# EAGLE design MegaButton Shiled (EAGLE 7.3.0)
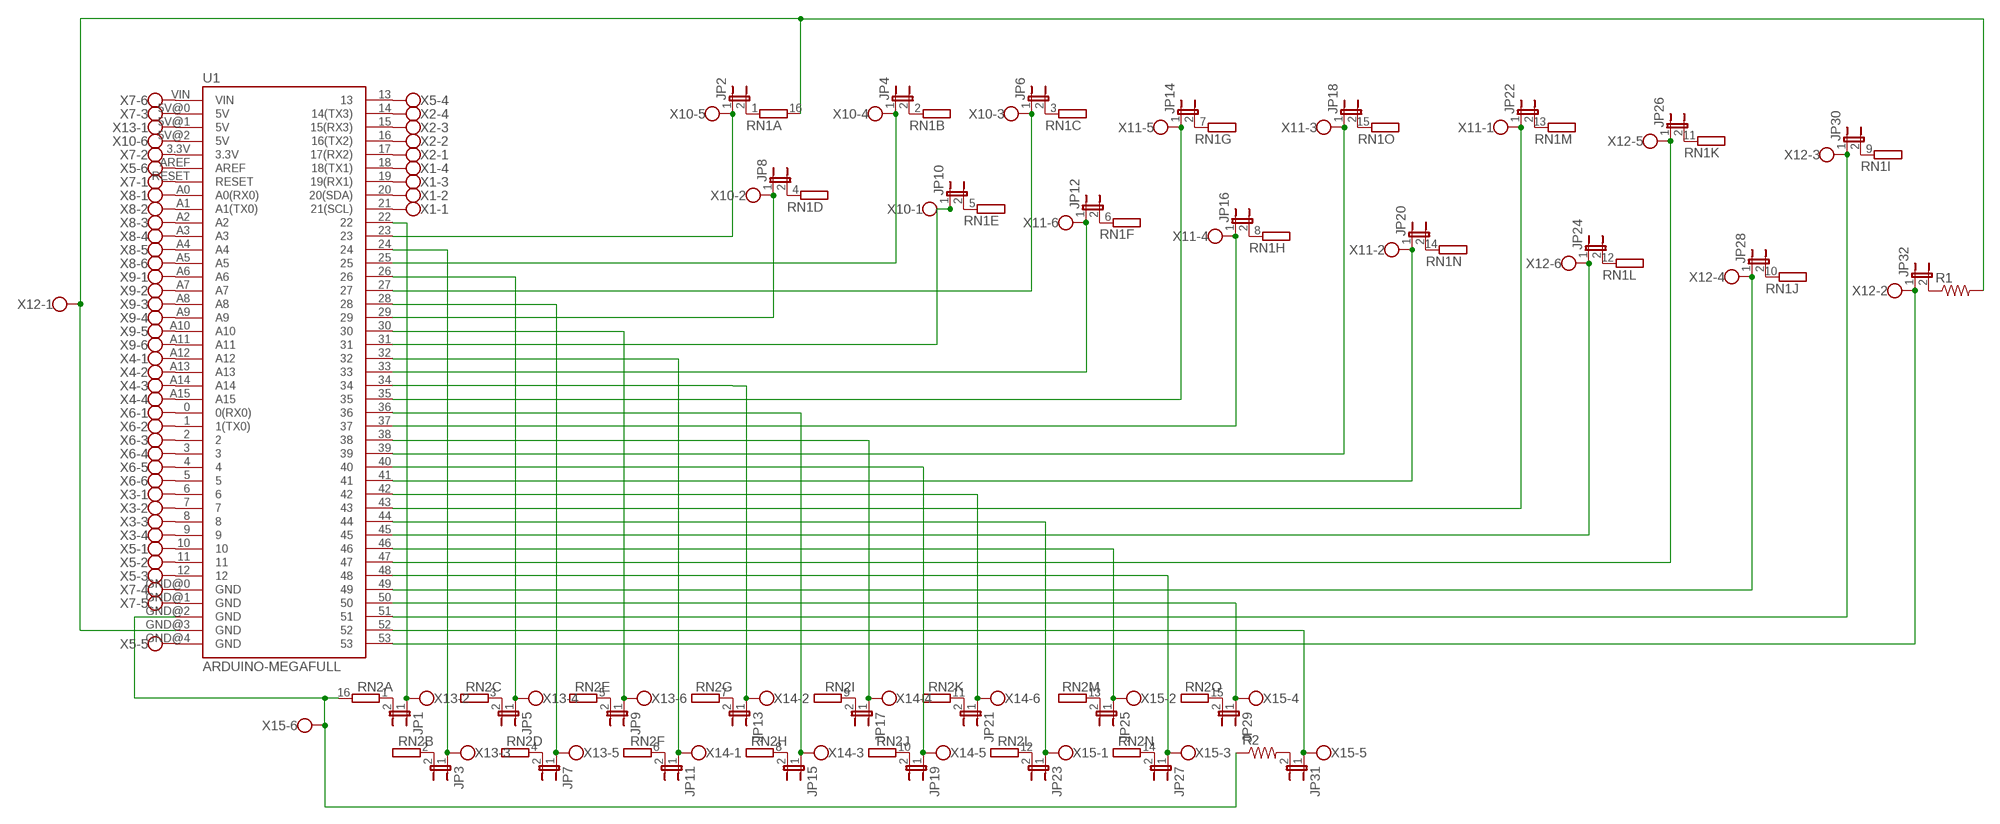
[diagram p0: schematic, sheet 1, part 1 of 2]
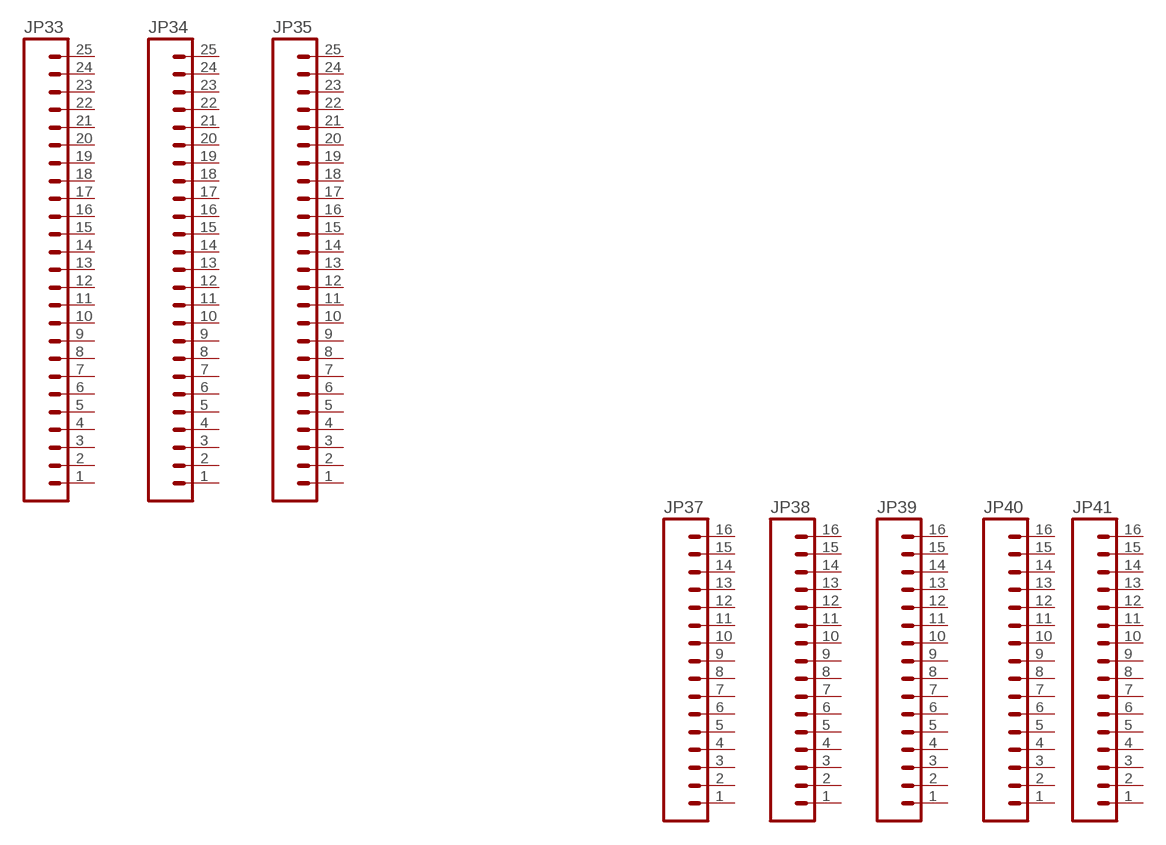
[diagram p1: schematic, sheet 1, part 2 of 2]

## Parts
JP1  JP1E  [JP1]
JP2  JP1E  [JP1]
JP3  JP1E  [JP1]
JP4  JP1E  [JP1]
JP5  JP1E  [JP1]
JP6  JP1E  [JP1]
JP7  JP1E  [JP1]
JP8  JP1E  [JP1]
JP9  JP1E  [JP1]
JP10  JP1E  [JP1]
JP11  JP1E  [JP1]
JP12  JP1E  [JP1]
JP13  JP1E  [JP1]
JP14  JP1E  [JP1]
JP15  JP1E  [JP1]
JP16  JP1E  [JP1]
JP17  JP1E  [JP1]
JP18  JP1E  [JP1]
JP19  JP1E  [JP1]
JP20  JP1E  [JP1]
JP21  JP1E  [JP1]
JP22  JP1E  [JP1]
JP23  JP1E  [JP1]
JP24  JP1E  [JP1]
JP25  JP1E  [JP1]
JP26  JP1E  [JP1]
JP27  JP1E  [JP1]
JP28  JP1E  [JP1]
JP29  JP1E  [JP1]
JP30  JP1E  [JP1]
JP31  JP1E  [JP1]
JP32  JP1E  [JP1]
JP33  M25PTH  [1X25]
JP34  M25PTH  [1X25]
JP35  M25PTH  [1X25]
JP37  M16PTH  [1X16]
JP38  M16PTH  [1X16]
JP39  M16PTH  [1X16]
JP40  M16PTH  [1X16]
JP41  M16PTH  [1X16]
R1  R-US_0204/5  [0204/5]
R2  R-US_0204/5  [0204/5]
RN1  E15R  [DIL16]
RN2  E15R  [DIL16]
U1  ARDUINO-MEGAFULL  [ARDUINO_MEGA]
X1  W237-4  [W237-4]
X2  W237-4  [W237-4]
X3  W237-4  [W237-4]
X4  W237-4  [W237-4]
X5  W237-136  [W237-136]
X6  W237-136  [W237-136]
X7  W237-136  [W237-136]
X8  W237-6  [W237-6]
X9  W237-6  [W237-6]
X10  W237-6  [W237-6]
X11  W237-6  [W237-6]
X12  W237-6  [W237-6]
X13  W237-6  [W237-6]
X14  W237-6  [W237-6]
X15  W237-6  [W237-6]

## Nets
N$1: U1.18(18(TX1)) X1.4
N$2: U1.19(19(RX1)) X1.3
N$3: U1.20(20(SDA)) X1.2
N$4: U1.21(21(SCL)) X1.1
N$5: U1.14(14(TX3)) X2.4
N$6: U1.15(15(RX3)) X2.3
N$7: U1.16(16(TX2)) X2.2
N$8: U1.17(17(RX2)) X2.1
N$9: U1.0(0(RX0)) X6.1
N$10: U1.1(1(TX0)) X6.2
N$11: U1.2 X6.3
N$12: U1.3 X6.4
N$13: U1.4 X6.5
N$14: U1.5 X6.6
N$15: U1.6 X3.1
N$16: U1.7 X3.2
N$17: U1.8 X3.3
N$18: U1.9 X3.4
N$19: U1.10 X5.1
N$20: U1.11 X5.2
N$21: U1.12 X5.3
N$22: U1.13 X5.4
N$23: U1.GND@4(GND) X5.5
N$24: U1.AREF X5.6
N$25: U1.RESET X7.1
N$26: U1.3.3V X7.2
N$27: U1.5V@0(5V) X7.3
N$28: U1.GND@0(GND) X7.4
N$29: U1.GND@1(GND) X7.5
N$30: U1.VIN X7.6
N$31: U1.A0(A0(RX0)) X8.1
N$32: U1.A1(A1(TX0)) X8.2
N$33: U1.A2 X8.3
N$34: U1.A3 X8.4
N$35: U1.A4 X8.5
N$36: U1.A5 X8.6
N$37: U1.A6 X9.1
N$38: U1.A7 X9.2
N$39: U1.A8 X9.3
N$40: U1.A9 X9.4
N$41: U1.A10 X9.5
N$42: U1.A11 X9.6
N$43: U1.A12 X4.1
N$44: U1.A13 X4.2
N$45: U1.A14 X4.3
N$46: U1.A15 X4.4
N$47: U1.5V@2(5V) X10.6
N$48: JP2.2 RN1.1
N$49: JP2.1 U1.23 X10.5
N$50: JP1.1 U1.22 X13.2
N$51: JP4.1 U1.25 X10.4
N$52: JP4.2 RN1.2
N$53: JP6.1 U1.27 X10.3
N$54: JP6.2 RN1.3
N$55: JP8.1 U1.29 X10.2
N$56: JP8.2 RN1.4
N$57: JP10.1 U1.31 X10.1
N$58: JP10.2 RN1.5
N$59: JP12.1 U1.33 X11.6
N$60: JP12.2 RN1.6
N$61: JP14.2 RN1.7
N$62: JP14.1 U1.35 X11.5
N$63: JP16.2 RN1.8
N$64: JP16.1 U1.37 X11.4
N$65: JP18.2 RN1.15
N$66: JP18.1 U1.39 X11.3
N$67: JP20.1 U1.41 X11.2
N$68: JP20.2 RN1.14
N$69: JP22.1 U1.43 X11.1
N$70: JP22.2 RN1.13
N$71: JP24.1 U1.45 X12.6
N$72: JP24.2 RN1.12
N$73: JP26.2 RN1.11
N$74: JP26.1 U1.47 X12.5
N$75: JP28.2 RN1.10
N$76: JP28.1 U1.49 X12.4
N$77: JP30.2 RN1.9
N$78: JP30.1 U1.51 X12.3
N$79: JP32.1 U1.53 X12.2
N$80: JP32.2 R1.1
N$82: JP1.2 RN2.1
N$83: U1.5V@1(5V) X13.1
N$85: JP3.2 RN2.2
N$86: JP3.1 U1.24 X13.3
N$87: JP5.2 RN2.3
N$88: JP5.1 U1.26 X13.4
N$89: JP7.2 RN2.4
N$90: JP7.1 U1.28 X13.5
N$91: JP9.2 RN2.5
N$92: JP9.1 U1.30 X13.6
N$93: JP11.2 RN2.6
N$94: JP11.1 U1.32 X14.1
N$95: JP13.2 RN2.7
N$96: JP13.1 U1.34 X14.2
N$97: JP15.2 RN2.8
N$98: JP15.1 U1.36 X14.3
N$99: JP17.2 RN2.9
N$100: JP17.1 U1.38 X14.4
N$101: JP19.2 RN2.10
N$102: JP19.1 U1.40 X14.5
N$103: JP21.2 RN2.11
N$104: JP21.1 U1.42 X14.6
N$105: JP23.2 RN2.12
N$106: JP23.1 U1.44 X15.1
N$107: JP25.2 RN2.13
N$108: JP25.1 U1.46 X15.2
N$109: R1.2 RN1.16 U1.GND@3(GND) X12.1
N$110: JP27.2 RN2.14
N$111: JP27.1 U1.48 X15.3
N$112: JP29.2 RN2.15
N$113: JP29.1 U1.50 X15.4
N$114: JP31.2 R2.2
N$115: JP31.1 U1.52 X15.5
N$130: R2.1 RN2.16 U1.GND@2(GND) X15.6
Unconnected: JP33.1 JP33.2 JP33.3 JP33.4 JP33.5 JP33.6 JP33.7 JP33.8 JP33.9 JP33.10 JP33.11 JP33.12 JP33.13 JP33.14 JP33.15 JP33.16 JP33.17 JP33.18 JP33.19 JP33.20 JP33.21 JP33.22 JP33.23 JP33.24 JP33.25 JP34.1 JP34.2 JP34.3 JP34.4 JP34.5 JP34.6 JP34.7 JP34.8 JP34.9 JP34.10 JP34.11 JP34.12 JP34.13 JP34.14 JP34.15 JP34.16 JP34.17 JP34.18 JP34.19 JP34.20 JP34.21 JP34.22 JP34.23 JP34.24 JP34.25 JP35.1 JP35.2 JP35.3 JP35.4 JP35.5 JP35.6 JP35.7 JP35.8 JP35.9 JP35.10 JP35.11 JP35.12 JP35.13 JP35.14 JP35.15 JP35.16 JP35.17 JP35.18 JP35.19 JP35.20 JP35.21 JP35.22 JP35.23 JP35.24 JP35.25 JP37.1 JP37.2 JP37.3 JP37.4 JP37.5 JP37.6 JP37.7 JP37.8 JP37.9 JP37.10 JP37.11 JP37.12 JP37.13 JP37.14 JP37.15 JP37.16 JP38.1 JP38.2 JP38.3 JP38.4 JP38.5 JP38.6 JP38.7 JP38.8 JP38.9 JP38.10 JP38.11 JP38.12 JP38.13 JP38.14 JP38.15 JP38.16 JP39.1 JP39.2 JP39.3 JP39.4 JP39.5 JP39.6 JP39.7 JP39.8 JP39.9 JP39.10 JP39.11 JP39.12 JP39.13 JP39.14 JP39.15 JP39.16 JP40.1 JP40.2 JP40.3 JP40.4 JP40.5 JP40.6 JP40.7 JP40.8 JP40.9 JP40.10 JP40.11 JP40.12 JP40.13 JP40.14 JP40.15 JP40.16 JP41.1 JP41.2 JP41.3 JP41.4 JP41.5 JP41.6 JP41.7 JP41.8 JP41.9 JP41.10 JP41.11 JP41.12 JP41.13 JP41.14 JP41.15 JP41.16

## Library data of the parts
JP1-JP32 = jumper:JP1E: JUMPER
JP33-JP35 = SparkFun-Connectors:M25: 1x25 .1" header
JP37-JP41 = SparkFun-Connectors:M16: 1x16 .1" header
R1 R2 = resistor:R-US_: RESISTOR, American symbol
RN1 RN2 = resistor-dil:E15R: DIL RESISTOR; OC_FARNELL: unknown; OC_NEWARK: unknown
U1 = SparkFun-Boards:ARDUINO-MEGA: Arduino Mega board footprint
X1-X4 = con-wago-500:W237-4: WAGO SCREW CLAMP; OC_FARNELL: unknown; OC_NEWARK: unknown
X5-X7 = con-wago-500:W237-136: WAGO SCREW CLAMP; MPN: 237-136; OC_FARNELL: unknown; OC_NEWARK: 84K9151
X8-X15 = con-wago-500:W237-6: WAGO SCREW CLAMP; OC_FARNELL: unknown; OC_NEWARK: unknown

## Board
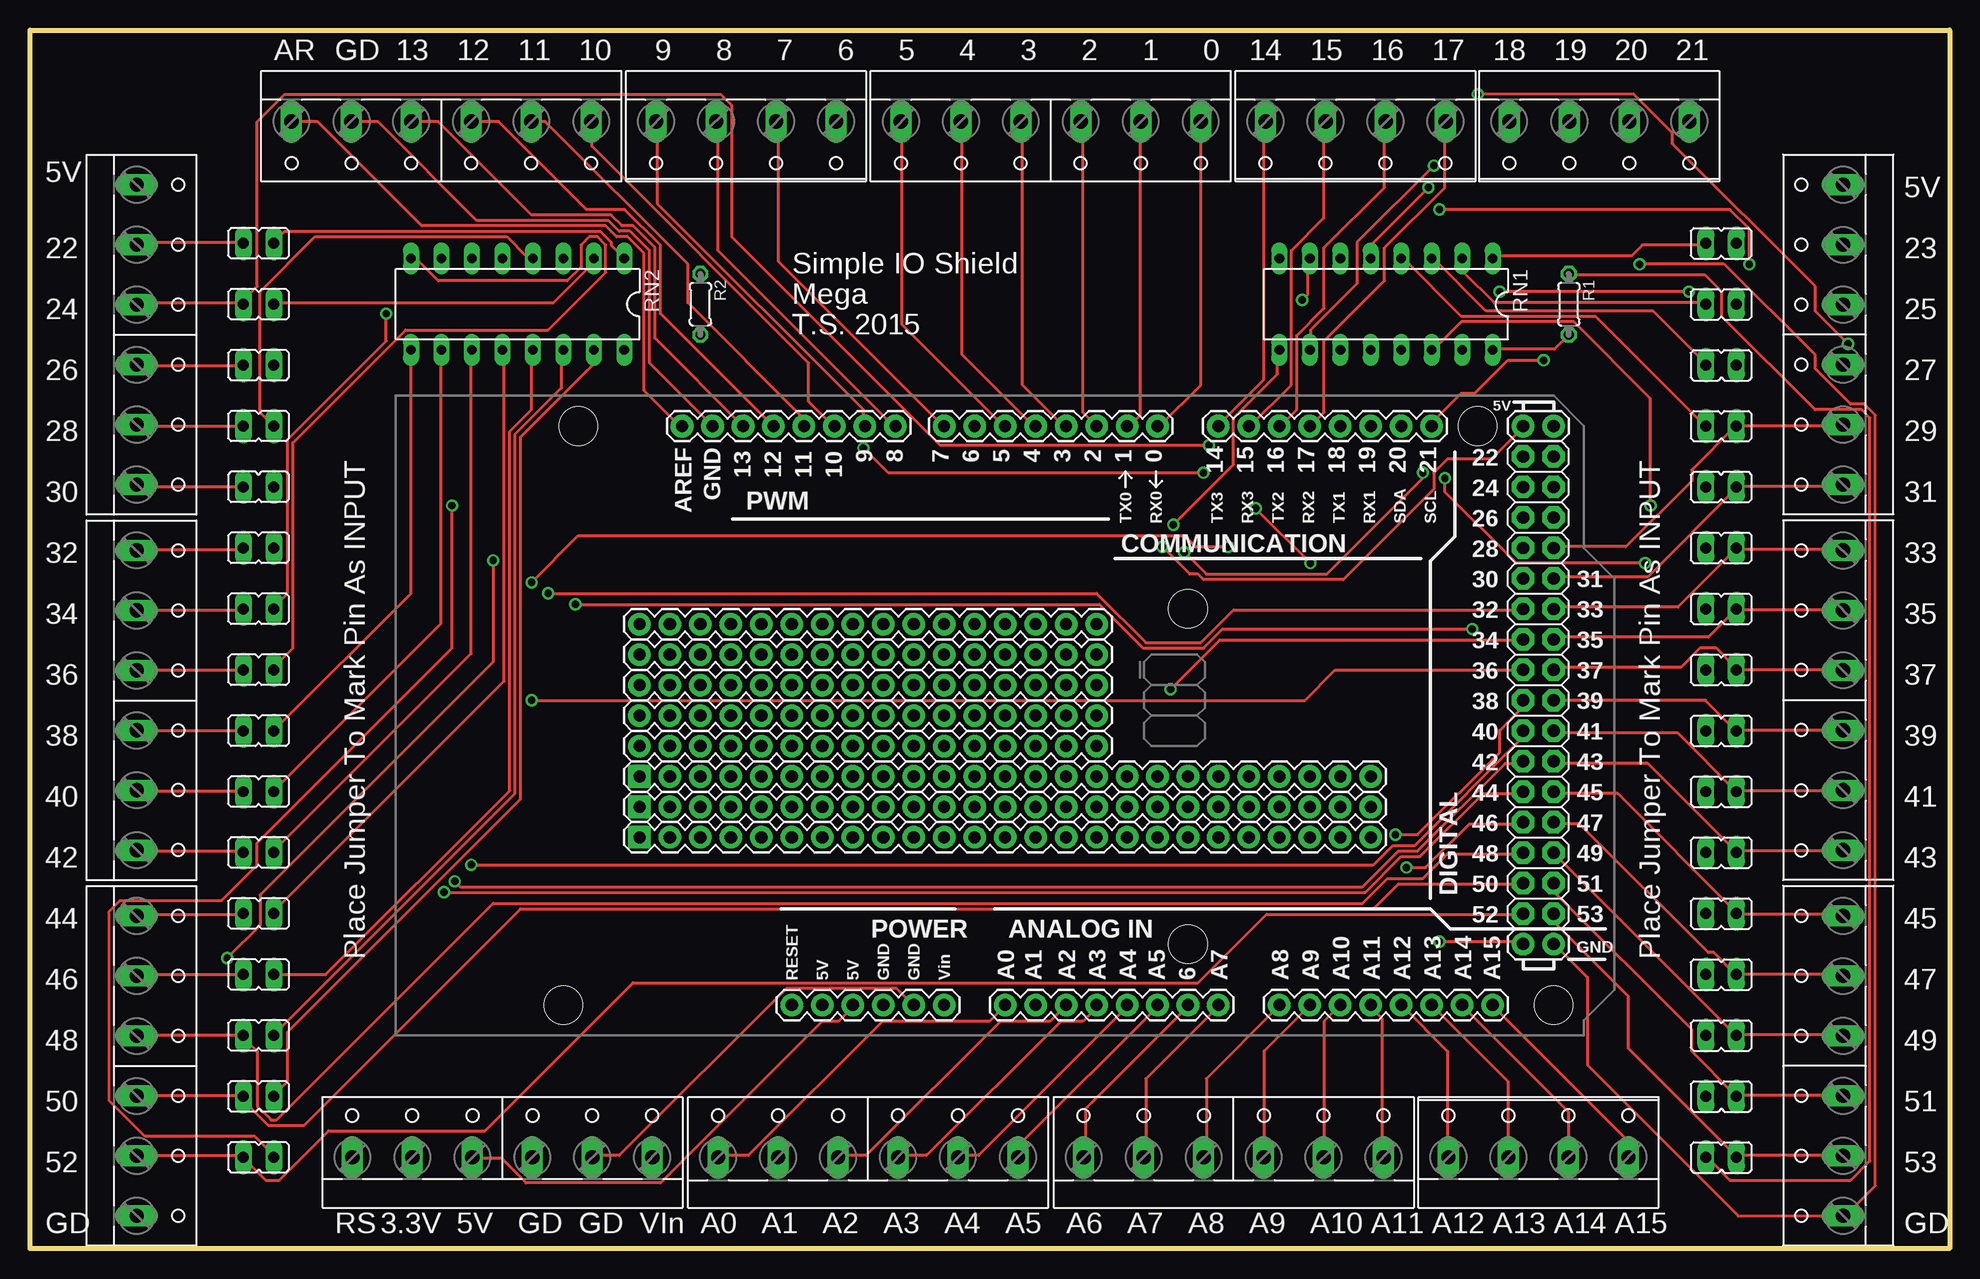
[diagram p2: board, top side]
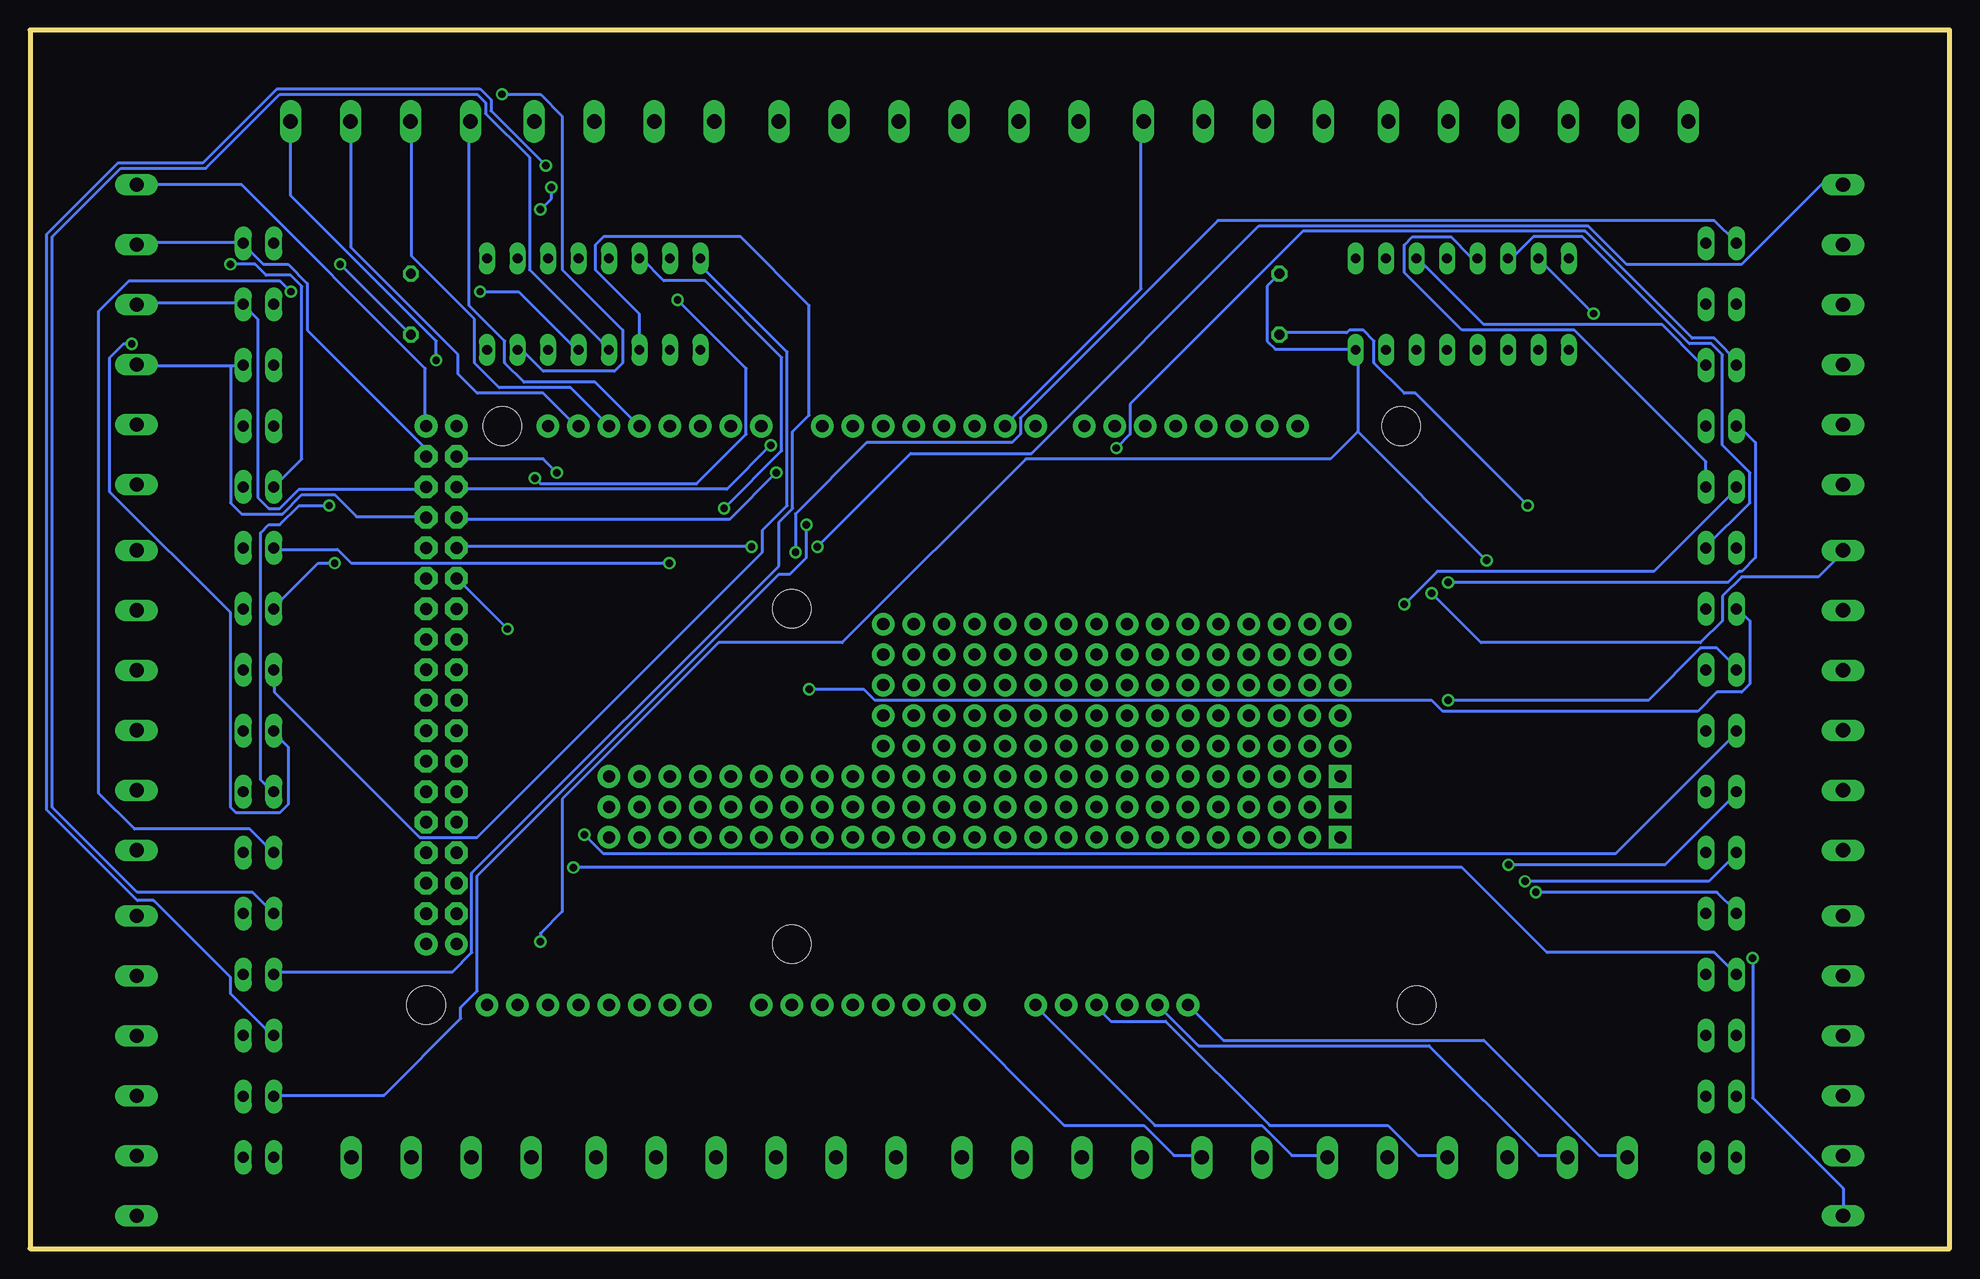
[diagram p3: board, bottom side, seen from below]

Size 160.02 x 101.6 mm. Coordinates in mm from the lower left corner, seen from the top.
Outline: 0,0 0,101.6 160.02,101.6 160.02,0 0,0
Copper layers (1*16): Top 0.035mm / dielectric 1.5mm / Bottom 0.035mm
Design rules "default": minimum track width 10mil, minimum drill 24mil, track to track 8mil, track to pad 8mil, pad to pad 8mil, via to via 8mil, smd to smd 8mil, copper to edge 40mil, drill to drill 8mil, minimum pad ring 10mil, minimum via ring 8mil, stop-mask expansion 4mil, vias tented up to drill 0mil, thermal gap 10mil

### Footprints (pad centres in the part's own frame; a part is rotated, then mirrored left to right if it is on the bottom)
JP1 = drill 0.914 long: 1 0,-1.27; 2 0,1.27
1X25 = drill 1.016 pad 1.88 square: 1 0,0 | drill 1.016 pad 1.88: 2 2.54,0; 3 5.08,0; 4 7.62,0; 5 10.16,0; 6 12.7,0; 7 15.24,0; 8 17.78,0; 9 20.32,0; 10 22.86,0; 11 25.4,0; 12 27.94,0; 13 30.48,0; 14 33.02,0; 15 35.56,0; 16 38.1,0; 17 40.64,0; 18 43.18,0; 19 45.72,0; 20 48.26,0; 21 50.8,0; 22 53.34,0; 23 55.88,0; 24 58.42,0; 25 60.96,0
1X16 = drill 1.016 pad 1.88: 1 0,0; 2 2.54,0; 3 5.08,0; 4 7.62,0; 5 10.16,0; 6 12.7,0; 7 15.24,0; 8 17.78,0; 9 20.32,0; 10 22.86,0; 11 25.4,0; 12 27.94,0; 13 30.48,0; 14 33.02,0; 15 35.56,0; 16 38.1,0
0204/5 = drill 0.813 octagon: 1 -2.54,0; 2 2.54,0
DIL16 = drill 0.813 long: 1 -8.89,-3.81; 2 -6.35,-3.81; 3 -3.81,-3.81; 4 -1.27,-3.81; 5 1.27,-3.81; 6 3.81,-3.81; 7 6.35,-3.81; 8 8.89,-3.81; 9 8.89,3.81; 10 6.35,3.81; 11 3.81,3.81; 12 1.27,3.81; 13 -1.27,3.81; 14 -3.81,3.81; 15 -6.35,3.81; 16 -8.89,3.81
ARDUINO_MEGA = drill 1.016 pad 1.88: 0 63.5,50.8; 1 60.96,50.8; 2 58.42,50.8; 3 55.88,50.8; 3.3V 35.56,2.54; 4 53.34,50.8; 5 50.8,50.8; 5V@0 38.1,2.54; 5V@1 93.98,50.8; 5V@2 96.52,50.8; 6 48.26,50.8; 7 45.72,50.8; 8 41.656,50.8; 9 39.116,50.8; 10 36.576,50.8; 11 34.036,50.8; 12 31.496,50.8; 13 28.956,50.8; 14 68.58,50.8; 15 71.12,50.8; 16 73.66,50.8; 17 76.2,50.8; 18 78.74,50.8; 19 81.28,50.8; 20 83.82,50.8; 21 86.36,50.8; A0 50.8,2.54; A1 53.34,2.54; A2 55.88,2.54; A3 58.42,2.54; A4 60.96,2.54; A5 63.5,2.54; A6 66.04,2.54; A7 68.58,2.54; A8 73.66,2.54; A9 76.2,2.54; A10 78.74,2.54; A11 81.28,2.54; A12 83.82,2.54; A13 86.36,2.54; A14 88.9,2.54; A15 91.44,2.54; AREF 23.876,50.8; GND@0 40.64,2.54; GND@1 43.18,2.54; GND@2 93.98,7.62; GND@3 96.52,7.62; GND@4 26.416,50.8; RESET 33.02,2.54; VIN 45.72,2.54 | drill 1.016 pad 1.88 octagon: 22 93.98,48.26; 23 96.52,48.26; 24 93.98,45.72; 25 96.52,45.72; 26 93.98,43.18; 27 96.52,43.18; 28 93.98,40.64; 29 96.52,40.64; 30 93.98,38.1; 31 96.52,38.1; 32 93.98,35.56; 33 96.52,35.56; 34 93.98,33.02; 35 96.52,33.02; 36 93.98,30.48; 37 96.52,30.48; 38 93.98,27.94; 39 96.52,27.94; 40 93.98,25.4; 41 96.52,25.4; 42 93.98,22.86; 43 96.52,22.86; 44 93.98,20.32; 45 96.52,20.32; 46 93.98,17.78; 47 96.52,17.78; 48 93.98,15.24; 49 96.52,15.24; 50 93.98,12.7; 51 96.52,12.7; 52 93.98,10.16; 53 96.52,10.16 | hole 3.2: 15.24,50.8; 13.97,2.54; 66.04,35.56; 66.04,7.62; 90.17,50.8; 96.52,2.54
W237-4 = drill 1.194 long: 1 -7.5,-1.27; 2 -2.5,-1.27; 3 2.5,-1.27; 4 7.5,-1.27
W237-136 = drill 1.194 long: 1 -12.5,-1.27; 2 -7.5,-1.27; 3 -2.5,-1.27; 4 2.5,-1.27; 5 7.5,-1.27; 6 12.5,-1.27
W237-6 = drill 1.194 long: 1 -12.5,-1.27; 2 -7.5,-1.27; 3 -2.5,-1.27; 4 2.5,-1.27; 5 7.5,-1.27; 6 12.5,-1.27

### Placement (x,y rotation side)
JP1  19.05,83.82 270 top
JP2  140.97,83.82 90 top
JP3  19.05,78.74 270 top
JP4  140.97,78.74 90 top
JP5  19.05,73.66 270 top
JP6  140.97,73.66 90 top
JP7  19.05,68.58 270 top
JP8  140.97,68.58 90 top
JP9  19.05,63.5 270 top
JP10  140.97,63.5 90 top
JP11  19.05,58.42 270 top
JP12  140.97,58.42 90 top
JP13  19.05,53.34 270 top
JP14  140.97,53.34 90 top
JP15  19.05,48.26 270 top
JP16  140.97,48.26 90 top
JP17  19.05,43.18 270 top
JP18  140.97,43.18 90 top
JP19  19.05,38.1 270 top
JP20  140.97,38.1 90 top
JP21  19.05,33.02 270 top
JP22  140.97,33.02 90 top
JP23  19.05,27.94 270 top
JP24  140.97,27.94 90 top
JP25  19.05,22.86 270 top
JP26  140.97,22.86 90 top
JP27  19.05,17.78 270 top
JP28  140.97,17.78 90 top
JP29  19.05,12.7 270 top
JP30  140.97,12.7 90 top
JP31  19.05,7.62 270 top
JP32  140.97,7.62 90 top
JP33  50.8,39.37 0 top
JP34  50.8,36.83 0 top
JP35  50.8,34.29 0 top
JP37  50.8,41.91 0 top
JP38  50.8,44.45 0 top
JP39  50.8,46.99 0 top
JP40  50.8,49.53 0 top
JP41  50.8,52.07 0 top
R1  128.27,78.74 270 top
R2  55.88,78.74 270 top
RN1  113.03,78.74 180 top
RN2  40.64,78.74 180 top
U1  30.48,17.78 0 top
X1  130.81,92.71 180 top
X2  110.49,92.71 180 top
X3  59.69,92.71 180 top
X4  125.73,8.89 0 top
X5  34.29,92.71 180 top
X6  85.09,92.71 180 top
X7  39.37,8.89 0 top
X8  69.85,8.89 0 top
X9  100.33,8.89 0 top
X10  149.86,76.2 90 top
X11  149.86,45.72 90 top
X12  149.86,15.24 90 top
X13  10.16,76.2 270 top
X14  10.16,45.72 270 top
X15  10.16,15.24 270 top

### Tracks (layer width: path | path; a pad name or v marks a point on that pad's centre or on a via)
N$1
  Bottom 0.254: X1.4 123.42,93.95 123.42,78.64 120.45,75.67 120.45,73.84 118.85,72.24 112.9,72.24 109.24,68.58 U1.18
N$2
  Bottom 0.254: U1.19 114.96,71.78 120.9,71.78 122.96,73.84 122.96,77.5 128.22,82.75 128.22,93.95 X1.3
N$3
  Bottom 0.254: X1.2 133.25,93.95 133.25,83.44 124.33,74.52 124.33,72.92 122.73,71.32 117.25,71.32 114.5,68.58 U1.20
N$4  (via drill 0.61)
  Top 0.254: v126.16,74.07 123.19,74.07 120.45,71.32 119.3,71.32 117.02,69.04 117.02,68.58 U1.21
  Bottom 0.254: v126.16,74.07 126.16,75.67 138.28,87.78 138.28,93.95 X1.1
N$5
  Top 0.254: X2.4 102.84,93.95 102.84,72.47 98.96,68.58 U1.14
N$6
  Top 0.254: X2.3 107.87,93.95 107.87,85.95 105.13,83.21 105.13,72.01 101.7,68.58 U1.15
N$7
  Top 0.254: X2.2 112.9,93.95 112.9,88.47 107.87,83.44 107.87,78.41 105.59,76.12 105.59,69.95 104.22,68.58 U1.16
N$8
  Top 0.254: X2.1 117.93,93.95 117.93,88.47 112.9,83.44 112.9,80.7 107.87,75.67 107.87,69.72 106.73,68.58 U1.17
N$9
  Top 0.254: X6.1 97.59,93.95 97.59,72.01 94.16,68.58 U1.0
N$10
  Top 0.254: X6.2 92.56,93.95 92.56,69.49 91.64,68.58 U1.1
N$11
  Top 0.254: U1.2 87.76,69.72 87.76,93.95 X6.3
N$12
  Top 0.254: X6.4 82.73,93.95 82.73,72.01 86.16,68.58 U1.3
N$13
  Top 0.254: X6.5 77.7,93.95 77.7,74.52 83.64,68.58 U1.4
N$14
  Top 0.254: X6.6 72.67,93.95 72.67,77.04 81.13,68.58 U1.5
N$15
  Bottom 0.254: X3.1 67.41,93.95 67.41,80.01 78.84,68.58 U1.6
N$16
  Top 0.254: X3.2 62.38,93.95 62.38,82.3 76.1,68.58 U1.7
N$17
  Top 0.254: X3.3 57.35,93.95 57.35,83.21 71.98,68.58 U1.8
N$18
  Top 0.254: X3.4 52.32,93.95 52.32,87.1 69.47,69.95 69.47,68.58 U1.9
N$19
  Top 0.254: X5.1 46.84,93.95 46.84,91.9 64.9,73.84 64.9,70.64 66.95,68.58 U1.10
N$20
  Top 0.254: X5.2 41.81,93.95 42.95,93.95 54.84,82.07 54.84,78.87 64.44,69.27 64.44,68.58 U1.11
N$21
  Top 0.254: X5.3 37.01,93.95 39.06,93.95 46.38,86.64 49.58,86.64 52.55,83.67 52.55,77.95 61.93,68.58 U1.12
N$22
  Top 0.254: X5.4 31.98,93.95 34.04,93.95 41.81,86.18 48.44,86.18 49.35,85.27 50.27,85.27 52.09,83.44 52.09,75.89 59.41,68.58 U1.13
N$23
  Top 0.254: U1.GND@4 51.64,73.84 51.64,83.21 50.04,84.81 49.12,84.81 48.21,85.72 37.24,85.72 29.01,93.95 26.95,93.95 X5.5
N$24
  Top 0.254: X5.6 21.92,93.95 23.98,93.95 32.66,85.27 47.98,85.27 48.9,84.35 49.81,84.35 51.18,82.98 51.18,71.55 54.15,68.58 U1.AREF
N$25
  Bottom 0.254: U1.RESET 60.55,17.37 38.84,17.37 29.23,7.77 26.95,7.77 X7.1
N$26
  Bottom 0.254: X7.2 31.98,7.77 34.27,7.77 43.41,16.92 62.61,16.92 66.04,20.34 U1.3.3V
N$27
  Top 0.254: X7.3 37.01,7.54 39.29,7.54 41.35,5.49 52.55,5.49 66.04,18.97 67.41,18.97 68.55,20.12 U1.5V@0
N$28
  Bottom 0.254: X7.4 42.04,7.77 44.32,7.77 46.84,10.29 56.67,10.29 65.35,18.97 69.93,18.97 71.07,20.12 U1.GND@0
N$29
  Top 0.254: X7.5 47.07,7.77 49.12,7.77 63.07,21.72 72.21,21.72 73.58,20.34 U1.GND@1
N$30
  Bottom 0.254: X7.6 52.09,7.77 54.84,7.77 57.35,10.29 66.27,10.29 76.1,20.12 U1.VIN
N$31
  Top 0.254: X8.1 57.35,7.77 59.87,7.77 71.07,18.97 79.98,18.97 81.13,20.12 U1.A0
N$32
  Bottom 0.254: X8.2 62.38,7.77 64.67,7.77 67.18,10.29 73.81,10.29 83.64,20.12 U1.A1
N$33
  Top 0.254: U1.A2 85.01,18.97 80.9,18.97 69.7,7.77 67.41,7.77 X8.3
N$34
  Top 0.254: X8.4 72.44,7.77 74.73,7.77 85.93,18.97 87.76,18.97 88.9,20.12 U1.A3
N$35
  Top 0.254: X8.5 77.47,7.77 79.07,7.77 91.41,20.12 U1.A4
N$36
  Top 0.254: X8.6 82.5,7.77 82.5,8.69 93.93,20.12 U1.A5
N$37
  Top 0.254: X9.1 87.99,7.77 87.99,11.66 96.44,20.12 U1.A6
N$38
  Top 0.254: X9.2 93.02,7.77 93.02,14.17 98.96,20.12 U1.A7
N$39
  Top 0.254: X9.3 98.04,7.77 98.04,14.17 103.99,20.12 U1.A8
N$40
  Top 0.254: X9.4 102.84,7.77 102.84,16.46 106.5,20.12 U1.A9
N$41
  Top 0.254: U1.A10 107.87,18.97 107.87,7.77 X9.5
N$42
  Top 0.254: X9.6 112.67,7.77 112.67,19.2 111.76,20.12 U1.A11
N$43
  Top 0.254: U1.A12 118.16,16.46 118.16,7.77 X4.1
N$44
  Top 0.254: X4.2 123.19,7.77 123.19,13.95 117.02,20.12 U1.A13
N$45
  Top 0.254: X4.3 128.22,7.77 128.22,11.43 119.53,20.12 U1.A14
N$46
  Top 0.254: X4.4 133.02,7.77 133.02,9.14 122.05,20.12 U1.A15
N$47
  Bottom 0.254: X10.6 151.08,88.7 142.39,88.7 127.08,73.38 127.08,68.58 U1.5V@2
N$48
  Top 0.254: RN1.1 122.05,82.75 133.48,82.75 134.39,83.67 139.65,83.67 JP2.2
N$49
  Bottom 0.254: X10.5 151.08,83.9 142.39,83.9 JP2.1 142.16,83.67 140.56,82.07 138.51,82.07 136.91,80.47 136.91,76.58 127.08,66.75 127.08,66.06 U1.23
N$50  (via drill 0.61)
  Top 0.254: JP1.1 17.58,83.9 8.89,83.9 X13.2 | v116.1,64.69 116.1,64.24 108.1,56.24 98.04,56.24 v96.21,58.06
  Bottom 0.254: v116.1,64.69 117.25,65.84 124.33,65.84 U1.22 | v96.21,58.06 96.21,61.27 90.27,67.21 78.16,67.21 77.47,67.89 77.47,69.27 61.01,85.72 19.63,85.72 17.8,83.9 JP1.1
N$51
  Bottom 0.254: X10.4 151.08,78.87 142.39,78.87 JP4.1 142.16,78.64 141.02,77.5 141.02,62.64 140.11,61.72 139.19,61.72 137.59,63.32 127.08,63.32 U1.25
N$52
  Top 0.254: RN1.2 119.53,82.53 119.53,81.38 122.05,78.87 139.65,78.87 JP4.2
N$53
  Bottom 0.254: 143.31,73.61 151.08,73.61 X10.3 | 143.31,73.61 142.39,73.61 JP6.1 | 143.31,73.61 143.31,62.18 142.39,61.27 138.96,61.27 137.36,62.87 134.62,62.87 132.79,61.04 127.08,61.04 U1.27
N$54
  Top 0.254: RN1.3 117.02,82.53 121.36,78.18 135.31,78.18 139.65,73.84 JP6.2
N$55
  Top 0.254: X10.2 151.08,68.58 JP8.1 142.16,68.58 138.51,64.92 138.51,64.01 133.02,58.52 127.08,58.52 U1.29
N$56
  Top 0.254: RN1.4 114.5,82.53 119.3,77.72 130.5,77.72 139.65,68.58 JP8.2
N$57
  Top 0.254: X10.1 151.08,63.55 142.39,63.55 JP10.1 142.16,63.32 134.85,56.01 127.08,56.01 U1.31
N$58  (via drill 0.61)
  Top 0.254: RN1.5 111.76,83.67 v116.56,88.47 | v117.47,86.64 141.71,86.64 143.31,85.04 v143.31,82.07
  Bottom 0.254: v116.56,88.47 116.56,87.55 v117.47,86.64 | v143.31,82.07 141.25,82.07 140.34,81.15 138.28,81.15 137.36,80.24 137.36,65.84 JP10.2
N$59
  Top 0.254: X11.6 151.08,58.29 142.39,58.29 JP12.1 142.16,58.29 137.36,53.49 127.08,53.49 U1.33
N$60  (via drill 0.61)
  Top 0.254: v106.73,57.15 v102.16,61.72
  Bottom 0.254: v102.16,61.72 97.36,66.52 97.36,74.3 103.76,80.7 107.19,80.7 109.02,82.53 RN1.6 | v106.73,57.15 133.25,57.15 134.39,58.29 139.65,58.29 JP12.2
N$61  (via drill 0.61)
  Top 0.254: v106.04,79.1 106.5,79.55 106.5,82.53 RN1.7 | v117.93,64.24 117.93,63.09 123.88,57.15 v134.62,57.15
  Bottom 0.254: v106.04,79.1 100.33,73.38 100.33,67.89 104.44,63.78 117.47,63.78 v117.93,64.24 | v134.62,57.15 135.99,57.15 139.65,53.49 JP14.2
N$62
  Top 0.254: X11.5 151.08,53.26 142.39,53.26 JP14.1 139.88,50.98 127.08,50.98 U1.35
N$63
  Bottom 0.254: RN1.8 103.99,82.53 103.99,81.84 96.9,74.75 96.9,61.95 98.96,59.89 98.96,58.06 122.73,34.29 127.53,34.29 139.65,46.41 139.65,48.23 JP16.2
N$64
  Top 0.254: X11.4 151.08,48.23 142.39,48.23 JP16.1 142.16,48.46 140.56,50.06 139.19,50.06 137.59,48.46 127.08,48.46 U1.37
N$65  (via drill 0.61)
  Top 0.254: v120.67,96.24 133.71,96.24 136.91,93.04 136.91,92.13 148.79,80.24 148.79,78.18 v151.54,75.44
  Bottom 0.254: v120.67,96.24 117.47,96.24 115.65,94.41 115.65,81.61 110.62,76.58 110.62,73.84 111.3,73.15 117.25,73.15 118.85,74.75 119.3,74.75 RN1.15 | v151.54,75.44 152.22,75.44 153.37,74.3 153.37,63.09 143.31,53.03 143.31,36.8 142.85,36.35 139.19,36.35 138.51,37.03 138.51,41.83 139.65,42.98 JP18.2
N$66
  Top 0.254: X11.3 151.08,43.2 142.39,43.2 JP18.1 142.16,43.2 139.65,45.72 U1.39
N$67
  Top 0.254: X11.2 151.08,38.18 142.39,38.18 JP20.1 137.36,42.98 127.08,42.98 U1.41
N$68  (via drill 0.61)
  Top 0.254: v135.08,61.95 135.08,70.87 128.68,77.27 119.3,77.27 117.02,74.98 RN1.14
  Bottom 0.254: v135.08,61.95 137.59,61.95 139.19,60.35 140.11,60.35 140.79,59.66 140.79,39.09 139.88,38.18 JP20.2
N$69
  Top 0.254: X11.1 151.08,33.15 142.39,33.15 JP22.1 142.16,33.15 134.85,40.46 127.08,40.46 U1.43
N$70  (via drill 0.61)
  Top 0.254: v138.28,79.78 v122.5,79.78
  Bottom 0.254: v122.5,79.78 119.3,79.78 114.5,74.98 RN1.13 | v138.28,79.78 139.19,80.7 151.77,80.7 154.28,78.18 154.28,37.95 151.31,34.98 141.71,34.98 139.88,33.15 JP22.2
N$71
  Top 0.254: X12.6 151.08,27.89 142.39,27.89 JP24.1 142.16,28.12 132.33,37.95 127.08,37.95 U1.45
N$72
  Bottom 0.254: JP24.2 141.48,29.72 151.08,29.72 158.17,36.8 158.17,84.35 152.45,90.07 145.36,90.07 139.19,96.24 122.73,96.24 122.05,95.56 122.05,94.64 118.39,90.98 118.39,81.61 111.76,74.98 RN1.12
N$73
  Bottom 0.254: RN1.11 109.24,74.98 109.24,77.95 112.9,81.61 112.9,83.67 112.22,84.35 100.79,84.35 95.07,78.64 95.07,69.49 96.44,68.12 96.44,61.72 97.59,60.58 97.59,56.92 123.19,31.32 123.19,24.69 124.79,23.09 139.42,23.09 139.65,22.86 JP26.2
N$74
  Top 0.254: X12.5 151.08,22.86 JP26.1 142.16,22.86 140.34,24.69 139.88,24.69 129.13,35.43 127.08,35.43 U1.47
N$75  (via drill 0.61)
  Top 0.254: v117.02,90.3 110.62,83.9 110.62,80.47 106.73,76.58 106.73,74.98 RN1.10
  Bottom 0.254: v117.02,90.3 121.59,94.87 121.59,95.78 122.5,96.7 139.42,96.7 145.59,90.53 152.68,90.53 158.62,84.58 158.62,36.58 151.08,29.03 149.71,29.03 143.31,22.63 143.31,21.26 139.88,17.83 JP28.2
N$76
  Top 0.254: X12.4 151.08,17.83 142.39,17.83 JP28.1 142.16,17.83 127.08,32.92 U1.49
N$77  (via drill 0.61)
  Top 0.254: v95.3,60.35 100.33,65.38 100.33,69.27 103.99,72.92 103.99,74.75 RN1.9
  Bottom 0.254: v95.3,60.35 95.3,57.61 96.67,56.24 97.59,56.24 122.73,31.09 122.73,21.49 124.1,20.12 124.1,19.2 130.5,12.8 139.65,12.8 JP30.2
N$78
  Top 0.254: X12.3 151.08,12.8 142.39,12.8 JP30.1 142.16,12.8 138.51,16.46 138.51,18.29 127.08,29.72 127.08,30.4 U1.51
N$79
  Top 0.254: X12.2 151.08,7.77 142.39,7.77 JP32.1 142.16,7.77 133.25,16.69 133.25,21.03 127.08,27.2 127.08,27.89 U1.53
N$80
  Top 0.254: R1.1 128.45,81.15 139.65,81.15 141.02,79.78 141.02,77.72 148.79,69.95 152.68,69.95 153.37,69.27 153.37,7.32 151.77,5.71 141.71,5.71 139.88,7.54 JP32.2
N$82
  Top 0.254: RN2.1 49.35,82.75 48.44,83.67 48.44,83.9 47.52,84.81 21.23,84.81 20.32,83.9 JP1.2
N$83  (via drill 0.61)
  Top 0.254: v94.39,58.52 96.67,56.24 97.36,56.24 97.81,55.78 109.47,55.78 117.02,63.32 117.02,64.69 118.16,65.84 121.82,65.84 124.56,68.58 U1.5V@1
  Bottom 0.254: v94.39,58.52 86.61,66.29 76.56,66.29 57.58,85.27 30.15,85.27 26.95,82.07 17.35,82.07 10.72,88.7 X13.1
N$85
  Top 0.254: RN2.2 46.84,82.53 46.84,82.07 43.64,78.87 20.32,78.87 JP3.2
N$86  (via drill 0.61)
  Top 0.254: 17.58,78.87 8.89,78.87 X13.3 | v98.27,66.98 75.87,66.98 58.5,84.35 58.5,95.33 57.58,96.24 21.23,96.24 18.95,93.95 18.95,80.24 17.58,78.87 | 17.58,78.87 JP3.1
  Bottom 0.254: v98.27,66.98 101.93,63.32 124.33,63.32 U1.24
N$87
  Bottom 0.254: RN2.3 44.32,82.53 38.84,77.04 23.98,77.04 20.78,73.84 20.32,73.84 JP5.2
N$88  (via drill 0.61)
  Top 0.254: JP5.1 17.58,73.61 8.89,73.61 X13.4 | v97.81,64.69 71.53,64.69 v69.47,66.75
  Bottom 0.254: v97.81,64.69 101.7,60.81 124.33,60.81 U1.26 | v69.47,66.75 68.33,67.89 68.33,70.41 53.92,84.81 30.38,84.81 21.46,75.89 19.63,75.89 17.58,73.84 JP5.1
N$89
  Top 0.254: JP7.2 19.18,69.72 19.18,79.78 23.75,84.35 39.75,84.35 41.35,82.75 41.81,82.75 RN2.4
N$90  (via drill 0.61)
  Top 0.254: JP7.1 8.89,68.58 X13.5 | v99.87,58.52 97.13,58.52 96.21,59.44 45.7,59.44 v41.81,55.55
  Bottom 0.254: v99.87,58.52 124.33,58.52 U1.28 | v41.81,55.55 18.49,55.55 17.58,56.46 17.35,56.46 16.21,57.61 16.21,67.21 17.58,68.58 JP7.1
N$91
  Bottom 0.254: JP9.2 20.32,65.61 31.29,76.58 40.66,76.58 45.47,81.38 45.47,83.67 44.78,84.35 41.58,84.35 39.98,82.75 39.52,82.75 RN2.5
N$92  (via drill 0.61)
  Top 0.254: JP9.1 17.58,63.55 8.89,63.55 X13.6 | v120.22,51.66 99.42,51.66 97.81,50.06 92.79,50.06 89.13,53.72 v45.47,53.72
  Bottom 0.254: v120.22,51.66 124.33,55.78 U1.30 | v45.47,53.72 42.72,56.46 24.66,56.46 17.8,63.32 JP9.1
N$93
  Bottom 0.254: RN2.6 36.78,82.75 36.32,82.75 34.72,84.35 30.61,84.35 21.69,75.44 19.86,75.44 18.95,74.52 18.95,66.98 16.66,64.69 16.66,62.18 20.32,58.52 JP11.2
N$94  (via drill 0.61)
  Top 0.254: JP11.1 17.58,58.29 8.89,58.29 X14.1 | v43.18,54.63 88.9,54.63 93.02,50.52 97.59,50.52 100.33,53.26 124.33,53.26 U1.32
  Bottom 0.254: v43.18,54.63 39.06,50.52 20.78,50.52 18.95,52.35 18.95,54.41 17.35,56.01 10.95,56.01 8.89,58.06 X14.1
N$95  (via drill 0.61)
  Top 0.254: v29.69,77.95 29.69,75.67 21.46,67.44 21.46,54.63 20.32,53.49 JP13.2
  Bottom 0.254: v29.69,77.95 RN2.7
N$96  (via drill 0.61)
  Top 0.254: JP13.1 17.58,53.26 8.89,53.26 X14.2 | v95.07,46.63 99.19,50.75 124.33,50.75 U1.34
  Bottom 0.254: v95.07,46.63 90.5,46.63 89.59,45.72 43.18,45.72 42.27,44.81 21.01,44.81 19.41,46.41 17.35,46.41 16.66,47.09 16.66,52.35 17.58,53.26 JP13.1
N$97
  Top 0.254: RN2.8 31.75,82.53 32.21,82.53 34.04,80.7 44.78,80.7 45.92,81.84 45.92,83.67 46.61,84.35 47.3,84.35 47.98,83.67 47.98,81.38 43.18,76.58 31.29,76.58 21.92,67.21 21.92,50.06 20.32,48.46 JP15.2
N$98  (via drill 0.61)
  Top 0.254: JP15.1 17.58,48.23 8.89,48.23 X14.3 | v41.81,45.72 106.27,45.72 108.79,48.23 124.33,48.23 U1.36
  Bottom 0.254: v41.81,45.72 25.12,45.72 20.78,50.06 19.41,50.06 17.8,48.46 JP15.1
N$99
  Top 0.254: RN2.9 31.75,54.63 20.32,43.2 JP17.2
N$100  (via drill 0.61)
  Top 0.254: JP17.1 17.58,43.2 8.89,43.2 X14.4 | v113.82,34.52 115.65,34.52 122.5,41.38 122.5,43.2 124.33,45.03 124.33,45.72 U1.38
  Bottom 0.254: v113.82,34.52 112.22,32.92 27.86,32.92 17.8,42.98 JP17.1
N$101
  Top 0.254: RN2.10 34.27,74.75 34.27,52.12 20.32,38.18 JP19.2
N$102  (via drill 0.61)
  Top 0.254: JP19.1 17.58,38.18 8.89,38.18 X14.5 | v36.78,32 111.99,32 113.59,33.6 115.42,33.6 124.33,42.52 124.33,42.98 U1.40
  Bottom 0.254: v36.78,32 23.75,32 17.8,37.95 JP19.1
N$103
  Top 0.254: RN2.11 36.78,74.75 36.78,49.61 20.32,33.15 JP21.2
N$104  (via drill 0.61)
  Top 0.254: JP21.1 17.58,33.15 8.89,33.15 X14.6 | v35.41,30.63 35.87,30.18 111.07,30.18 114.05,33.15 115.65,33.15 122.96,40.46 124.33,40.46 U1.42
  Bottom 0.254: v35.41,30.63 20.09,30.63 17.8,32.92 JP21.1
N$105
  Top 0.254: RN2.12 39.52,74.75 39.52,47.32 20.32,28.12 JP23.2
N$106  (via drill 0.61)
  Top 0.254: JP23.1 17.58,27.89 8.89,27.89 X15.1 | v34.49,29.72 111.3,29.72 114.27,32.69 115.88,32.69 121.13,37.95 124.33,37.95 U1.44
  Bottom 0.254: v34.49,29.72 19.41,29.72 17.8,28.12 JP23.1
N$107
  Top 0.254: JP25.2 24.66,22.86 39.98,38.18 39.98,68.12 41.81,69.95 41.81,74.75 RN2.13
N$108  (via drill 0.61)
  Top 0.254: JP25.1 8.89,22.86 X15.2 | v114.73,31.77 116.33,31.77 119.99,35.43 124.33,35.43 U1.46
  Bottom 0.254: v114.73,31.77 40.66,31.77 33.58,24.69 19.63,24.69 17.8,22.86 JP25.1
N$109  (via drill 0.61)
  Top 0.254: RN1.16 122.05,74.98 127.08,74.98 128.22,76.12 R1.2 | U1.GND@3 127.08,25.38 129.82,22.63 129.82,15.32 142.39,2.74 151.08,2.74 X12.1 151.31,2.74 153.82,5.26 153.82,69.49 152.91,70.41 151.77,70.41 148.79,73.38 148.79,74.52 141.25,82.07 v134.16,82.07
  Bottom 0.254: v134.16,82.07 128.45,76.35 R1.2
N$110
  Top 0.254: RN2.14 44.32,74.75 44.32,71.78 40.44,67.89 40.44,37.95 20.32,17.83 JP27.2
N$111
  Top 0.254: X15.3 8.89,17.83 17.58,17.83 JP27.1 17.8,17.6 18.95,16.46 18.95,11.89 20.09,10.74 20.55,10.74 38.61,28.8 111.07,28.8 113.13,30.86 116.1,30.86 118.16,32.92 124.33,32.92 U1.48
N$112
  Top 0.254: RN2.15 46.84,74.75 46.84,73.61 40.89,67.67 40.89,37.49 21.46,18.06 21.46,13.95 20.32,12.8 JP29.2
N$113
  Top 0.254: X15.4 8.89,12.8 17.58,12.8 JP29.1 17.58,12.57 19.86,10.29 22.84,10.29 40.89,28.35 111.99,28.35 114.05,30.4 124.33,30.4 U1.50
N$114  (via drill 0.61)
  Top 0.254: v35.18,61.95 35.18,50.06 18.95,33.83 18.95,32 15.98,29.03 7.52,29.03 6.6,28.12 6.6,12.34 9.58,9.37 18.72,9.37 20.32,7.77 JP31.2
  Bottom 0.254: v35.18,61.95 44.55,71.32 45.47,71.32 47.98,73.84 47.98,75.67 48.9,76.58 50.04,76.58 50.27,76.35 55.75,76.35 R2.2
N$115
  Top 0.254: X15.5 8.89,7.77 17.58,7.77 JP31.1 17.8,7.54 19.63,5.71 20.78,5.71 24.89,9.83 37.92,9.83 50.27,22.17 97.36,22.17 103.07,27.89 124.33,27.89 U1.52
N$130  (via drill 0.61)
  Top 0.254: v16.43,24.23 19.18,26.98 19.18,29.49 38.61,48.92 v38.61,57.38 | v117.47,25.6 124.33,25.6 U1.GND@2
  Bottom 0.254: R2.1 55.98,81.15 56.9,80.24 56.9,75.67 56.21,74.98 49.58,74.98 RN2.16 49.35,74.75 49.35,68.12 | X15.6 8.89,5.03 16.43,12.57 v16.43,24.23 | 49.35,68.12 v38.61,57.38 | v117.47,25.6 117.47,26.29 115.65,28.12 115.65,37.49 102.62,50.52 92.33,50.52 77.01,65.84 51.64,65.84 49.35,68.12

### Text on the board
tPlace: AR | GD | 13 | 12 | 11 | 10 | 9 | 8 | 7 | 6 | 5 | 4 | 3 | 2 | 1 | 0 | 14 | 15 | 16 | 17 | 18 | 19 | 20 | 21 | 5V | 5V | 22 | 23 | Simple IO Shield | Mega | 24 | 25 | T.S. 2015 | 26 | 27 | 28 | 29 | 30 | 31 | 32 | 33 | 34 | 35 | 36 | 37 | 38 | 39 | 40 | 41 | 42 | 43 | 44 | 45 | Place Jumper To Mark Pin As INPUT | Place Jumper To Mark Pin As INPUT | 46 | 47 | 48 | 49 | 50 | 51 | 52 | 53 | GD | RS | 3.3V | 5V | GD | GD | VIn | A0 | A1 | A2 | A3 | A4 | A5 | A6 | A7 | A8 | A9 | A10 | A11 | A12 | A13 | A14 | A15 | GD